# Altium schematic sheet PCB Sensor Sentuh kapasitif 6.SchDoc: PCB Sensor Sentuh Kapasitif 6
size A4; ApprovedBy: Imron Pramana; CheckedBy: Jimmy Andrianto; CompanyName: PT Elektrindodaya Pakarnusa; DrawnBy: Rangga Masli Putra; Address1: Jl. Soekarno Hatta km 13,8; Address2: Lingkungan Industri Kecil unit C8; Address3: Bandung; Address4: Indonesia; Revision: 1.0
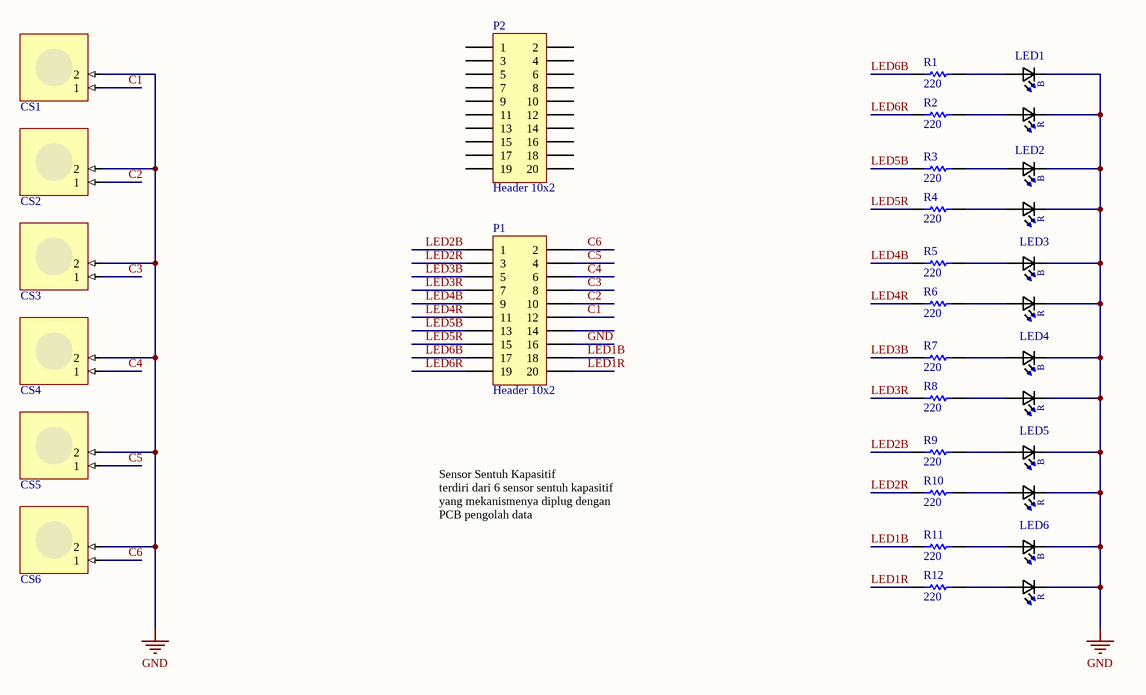
[diagram p0: PCB Sensor Sentuh kapasitif 6.SchDoc]

## Parts
CS1  Mutual Ring mTouch Sensor  (value not drawn)  (no BOM)
CS2  Mutual Ring mTouch Sensor  (value not drawn)  (no BOM)
CS3  Mutual Ring mTouch Sensor  (value not drawn)  (no BOM)
CS4  Mutual Ring mTouch Sensor  (value not drawn)  (no BOM)
CS5  Mutual Ring mTouch Sensor  (value not drawn)  (no BOM)
CS6  Mutual Ring mTouch Sensor  (value not drawn)  (no BOM)
LED1  LTST-C195KGJRKT  [LTST-BILED-15X16_LTST-C195KGJRKT(HOLE)]  (value not drawn)
LED2  LTST-C195KGJRKT  [LTST-BILED-15X16_LTST-C195KGJRKT(HOLE)]  (value not drawn)
LED3  LTST-C195KGJRKT  [LTST-BILED-15X16_LTST-C195KGJRKT(HOLE)]  (value not drawn)
LED4  LTST-C195KGJRKT  [LTST-BILED-15X16_LTST-C195KGJRKT(HOLE)]  (value not drawn)
LED5  LTST-C195KGJRKT  [LTST-BILED-15X16_LTST-C195KGJRKT(HOLE)]  (value not drawn)
LED6  LTST-C195KGJRKT  [LTST-BILED-15X16_LTST-C195KGJRKT(Primary)]  (value not drawn)
P1  Header 10x2  [HDR2X10 pitch 2mm male]
P2  Header 10x2  [HDR2X10 pitch 2mm male]
R1  value 220  [RESC1608M]  (hidden comment: Res1)
R2  value 220  [RESC1608M]  (hidden comment: Res1)
R3  value 220  [RESC1608M]  (hidden comment: Res1)
R4  value 220  [RESC1608M]  (hidden comment: Res1)
R5  value 220  [RESC1608M]  (hidden comment: Res1)
R6  value 220  [RESC1608M]  (hidden comment: Res1)
R7  value 220  [RESC1608M]  (hidden comment: Res1)
R8  value 220  [RESC1608M]  (hidden comment: Res1)
R9  value 220  [RESC1608M]  (hidden comment: Res1)
R10  value 220  [RESC1608M]  (hidden comment: Res1)
R11  value 220  [RESC1608M]  (hidden comment: Res1)
R12  value 220  [RESC1608M]  (hidden comment: Res1)

## Nets
GND: CS1.2 CS2.2 CS3.2 CS4.2 CS5.2 CS6.2 LED1.P$3(K1) LED1.P$4(K2) LED2.P$3(K1) LED2.P$4(K2) LED3.P$3(K1) LED3.P$4(K2) LED4.P$3(K1) LED4.P$4(K2) LED5.P$3(K1) LED5.P$4(K2) LED6.P$3(K1) LED6.P$4(K2) P1.16
C1: CS1.1 P1.12
C2: CS2.1 P1.10
C3: CS3.1 P1.8
C4: CS4.1 P1.6
C5: CS5.1 P1.4
C6: CS6.1 P1.2
LED1B: P1.18 R11.1
LED1R: P1.20 R12.1
LED2B: P1.1 R9.1
LED2R: P1.3 R10.1
LED3B: P1.5 R7.1
LED3R: P1.7 R8.1
LED4B: P1.9 R5.1
LED4R: P1.11 R6.1
LED5B: P1.13 R3.1
LED5R: P1.15 R4.1
LED6B: P1.17 R1.1
LED6R: P1.19 R2.1
NetLED1_P$1: LED1.P$1(A1) R1.2
NetLED1_P$2: LED1.P$2(A2) R2.2
NetLED2_P$1: LED2.P$1(A1) R3.2
NetLED2_P$2: LED2.P$2(A2) R4.2
NetLED3_P$1: LED3.P$1(A1) R5.2
NetLED3_P$2: LED3.P$2(A2) R6.2
NetLED4_P$1: LED4.P$1(A1) R7.2
NetLED4_P$2: LED4.P$2(A2) R8.2
NetLED5_P$1: LED5.P$1(A1) R9.2
NetLED5_P$2: LED5.P$2(A2) R10.2
NetLED6_P$1: LED6.P$1(A1) R11.2
NetLED6_P$2: LED6.P$2(A2) R12.2

Not connected (* = marked no-connect by the designer): P1 14; P2 1 2 3 4 5 6 7 8 9 10 11 12 13 14 15 16 17 18 19 20

## Notes on the sheet
- Sensor Sentuh Kapasitif
  terdiri dari 6 sensor sentuh kapasitif yang mekanismenya diplug dengan PCB pengolah data
- Date :
- Title :
- Time :
- Sheet:           of
- Revision :
- Draw by
- Check by
- Approved by
- Filename :
- (in symbol LTST-C195KGJRKT) B; R

## Library data of the parts
CS1-CS6 = mTouchMutualRingSensor: ConfiguratorName: MICROCHIP_TOUCH; ConfigurationParameters: {}__sensorid[MutualCircle]{}inPadRadius[5]{}middlePadWidth[1]{}outPadWidth[2]{}
LED1-LED6 = LTST-C195KGJRKT: Green/Red 130%C2%B0 Water Clear 35/25 mcd 2 V 0605 Surface Mount Bi-Color LED; MF: Lite-On; Availability: Good; Package: 0606 Lite-On; Price: 0.13 USD; MP: LTST-C195KGJRKT; Value: *
P1 P2 = Header 10x2: Header, 14-Pin, Dual row; LatestRevisionDate: 17-Jul-2002; LatestRevisionNote: Re-released for DXP Platform.; Publisher: Altium Limited
R1-R12 = Res1: Resistor; Published: 8-Jun-2000; LatestRevisionDate: 17-Jul-2002; LatestRevisionNote: Re-released for DXP Platform.; PackageReference: AXIAL-0.3; Publisher: Altium Limited; PackageDescription: Axial Device, Thru-Hole; 2 Leads; 0.3 in Pin Spacing